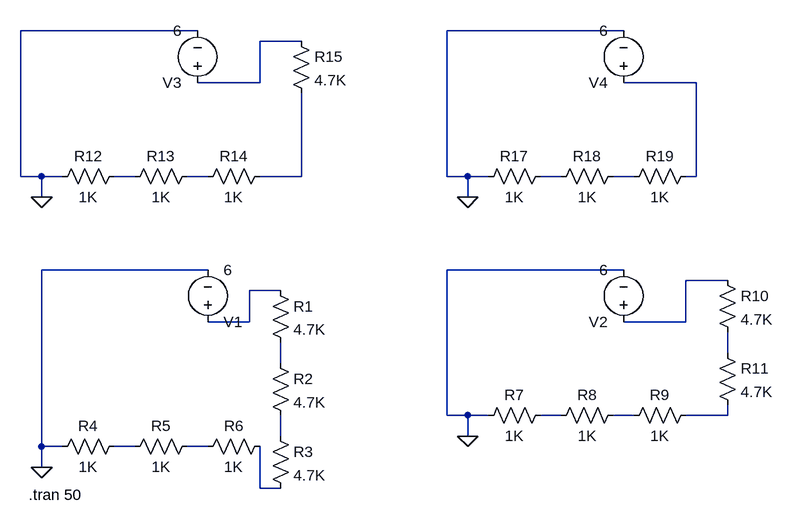
[diagram p0: schematic keypad_voltage_finder.asc]
keypad_voltage_finder.asc, the LTspice schematic file:
Version 4
SHEET 1 992 680
WIRE 96 -368 -176 -368
WIRE 752 -368 480 -368
WIRE 256 -352 192 -352
WIRE 192 -288 192 -352
WIRE 192 -288 96 -288
WIRE 864 -288 752 -288
WIRE -176 -144 -176 -368
WIRE -144 -144 -176 -144
WIRE -112 -144 -144 -144
WIRE 0 -144 -32 -144
WIRE 112 -144 80 -144
WIRE 256 -144 256 -272
WIRE 256 -144 192 -144
WIRE 480 -144 480 -368
WIRE 512 -144 480 -144
WIRE 544 -144 512 -144
WIRE 656 -144 624 -144
WIRE 768 -144 736 -144
WIRE 864 -144 864 -288
WIRE 864 -144 848 -144
WIRE -144 -112 -144 -144
WIRE 512 -112 512 -144
WIRE 112 0 -144 0
WIRE 752 0 480 0
WIRE 912 16 848 16
WIRE 224 32 176 32
WIRE 176 80 176 32
WIRE 176 80 112 80
WIRE 848 80 848 16
WIRE 848 80 752 80
WIRE 912 128 912 96
WIRE 224 144 224 112
WIRE 480 224 480 0
WIRE 512 224 480 224
WIRE 544 224 512 224
WIRE 656 224 624 224
WIRE 768 224 736 224
WIRE 912 224 912 208
WIRE 912 224 848 224
WIRE 224 256 224 224
WIRE 512 256 512 224
WIRE -144 272 -144 0
WIRE -112 272 -144 272
WIRE 0 272 -32 272
WIRE 112 272 80 272
WIRE -144 304 -144 272
WIRE 192 336 192 272
WIRE 224 336 192 336
FLAG -144 304 0
FLAG 512 256 0
FLAG -144 -112 0
FLAG 512 -112 0
SYMBOL res 208 16 R0
SYMATTR InstName R1
SYMATTR Value 4.7K
SYMBOL res 208 128 R0
SYMATTR InstName R2
SYMATTR Value 4.7K
SYMBOL res 208 240 R0
SYMATTR InstName R3
SYMATTR Value 4.7K
SYMBOL res -16 256 R90
WINDOW 0 0 56 VBottom 2
WINDOW 3 32 56 VTop 2
SYMATTR InstName R4
SYMATTR Value 1K
SYMBOL res 96 256 R90
WINDOW 0 0 56 VBottom 2
WINDOW 3 32 56 VTop 2
SYMATTR InstName R5
SYMATTR Value 1K
SYMBOL res 208 256 R90
WINDOW 0 0 56 VBottom 2
WINDOW 3 32 56 VTop 2
SYMATTR InstName R6
SYMATTR Value 1K
SYMBOL voltage 112 96 M180
WINDOW 123 0 0 Left 2
WINDOW 39 0 0 Left 2
SYMATTR InstName V1
SYMATTR Value 6
SYMBOL voltage 752 96 R180
WINDOW 123 0 0 Left 2
WINDOW 39 0 0 Left 2
SYMATTR InstName V2
SYMATTR Value 6
SYMBOL res 640 208 R90
WINDOW 0 0 56 VBottom 2
WINDOW 3 32 56 VTop 2
SYMATTR InstName R7
SYMATTR Value 1K
SYMBOL res 752 208 R90
WINDOW 0 0 56 VBottom 2
WINDOW 3 32 56 VTop 2
SYMATTR InstName R8
SYMATTR Value 1K
SYMBOL res 864 208 R90
WINDOW 0 0 56 VBottom 2
WINDOW 3 32 56 VTop 2
SYMATTR InstName R9
SYMATTR Value 1K
SYMBOL res 896 0 R0
SYMATTR InstName R10
SYMATTR Value 4.7K
SYMBOL res 896 112 R0
SYMATTR InstName R11
SYMATTR Value 4.7K
SYMBOL voltage 96 -272 R180
WINDOW 123 0 0 Left 2
WINDOW 39 0 0 Left 2
SYMATTR InstName V3
SYMATTR Value 6
SYMBOL res -16 -160 R90
WINDOW 0 0 56 VBottom 2
WINDOW 3 32 56 VTop 2
SYMATTR InstName R12
SYMATTR Value 1K
SYMBOL res 96 -160 R90
WINDOW 0 0 56 VBottom 2
WINDOW 3 32 56 VTop 2
SYMATTR InstName R13
SYMATTR Value 1K
SYMBOL res 208 -160 R90
WINDOW 0 0 56 VBottom 2
WINDOW 3 32 56 VTop 2
SYMATTR InstName R14
SYMATTR Value 1K
SYMBOL res 240 -368 R0
SYMATTR InstName R15
SYMATTR Value 4.7K
SYMBOL voltage 752 -272 R180
WINDOW 123 0 0 Left 2
WINDOW 39 0 0 Left 2
SYMATTR InstName V4
SYMATTR Value 6
SYMBOL res 640 -160 R90
WINDOW 0 0 56 VBottom 2
WINDOW 3 32 56 VTop 2
SYMATTR InstName R17
SYMATTR Value 1K
SYMBOL res 752 -160 R90
WINDOW 0 0 56 VBottom 2
WINDOW 3 32 56 VTop 2
SYMATTR InstName R18
SYMATTR Value 1K
SYMBOL res 864 -160 R90
WINDOW 0 0 56 VBottom 2
WINDOW 3 32 56 VTop 2
SYMATTR InstName R19
SYMATTR Value 1K
TEXT -164 346 Left 2 !.tran 50

The netlist it stands for:
* keypad_voltage_finder.asc
R1 N009 N011 4.7K
R2 N011 N015 4.7K
R3 N015 N018 4.7K
R4 N016 0 1K
R5 N017 N016 1K
R6 N018 N017 1K
V1 N009 0 6
V2 N008 0 6
R7 N012 0 1K
R8 N013 N012 1K
R9 N014 N013 1K
R10 N008 N010 4.7K
R11 N010 N014 4.7K
V3 N001 0 6
R12 N003 0 1K
R13 N004 N003 1K
R14 N005 N004 1K
R15 N001 N005 4.7K
V4 N002 0 6
R17 N006 0 1K
R18 N007 N006 1K
R19 N002 N007 1K
.tran 50
.backanno
.end